# EasyEDA Pro project V3-POJ-STM32F103C8T6最小系统.epro

# Schematic Schematic1
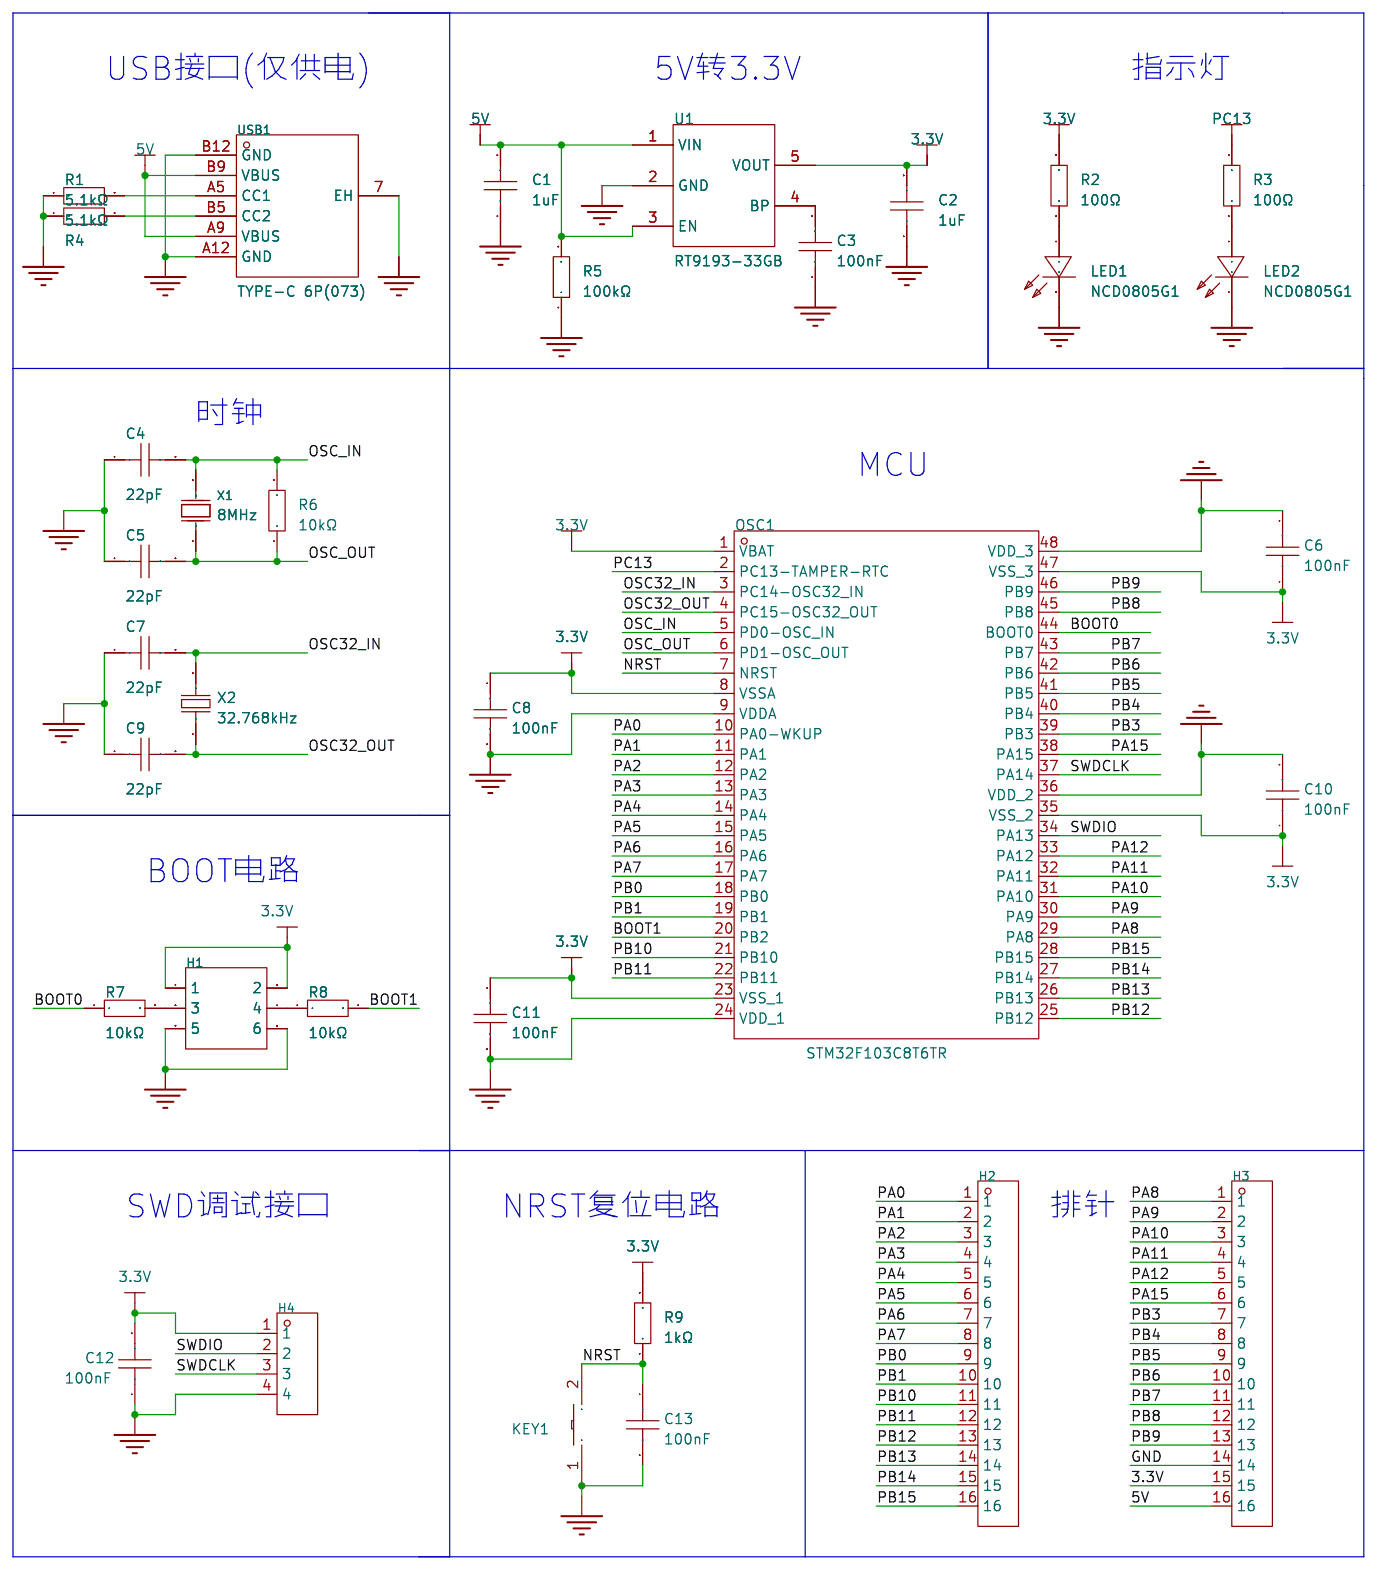
[diagram p0: schematic sheet]

## Parts
C1  1uF  [C0805]
C2  1uF  [C0805]
C3  100nF  [C0805]
C4  22pF  [C0805]
C5  22pF  [C0805]
C6  100nF  [C0805]
C7  22pF  [C0805]
C8  100nF  [C0805]
C9  22pF  [C0805]
C10  100nF  [C0805]
C11  100nF  [C0805]
C12  100nF  [C0805]
C13  100nF  [C0805]
H1  2.54-2*3P针  [HDR-TH_6P-P2.54-V-M-R2-C3-S2.54-1]
H2  X6511WV-16H-C30D60  [HDR-TH_16P-P2.54-V-M]
H3  X6511WV-16H-C30D60  [HDR-TH_16P-P2.54-V-M]
H4  PZ254R-11-04P  [HDR-TH_4P-P2.54-H-M-W10.4]
KEY1  TS-1101-C-W  [SW-SMD_L6.0-W3.3-LS8.0]
LED1  NCD0805G1  [LED0805-R-RD]
LED2  NCD0805G1  [LED0805-R-RD]
OSC1  STM32F103C8T6TR  [LQFP-48_L7.0-W7.0-P0.50-LS9.0-BL]
R1  5.1kΩ  [R0805]
R2  100Ω  [R0805]
R3  100Ω  [R0805]
R4  5.1kΩ  [R0805]
R5  100kΩ  [R0805]
R6  10kΩ  [R0805]
R7  10kΩ  [R0805]
R8  10kΩ  [R0805]
R9  1kΩ  [R0805]
U1  RT9193-33GB  [SOT-23-5_L3.0-W1.7-P0.95-LS2.8-BL]
USB1  TYPE-C 6P(073)  [TYPE-C-SMD_TYPE-C-6P]
X1  8MHz  [CRYSTAL-SMD_L5.0-W3.2]
X2  32.768kHz  [FC-135R_L3.2-W1.5]

## Library data of the parts
C1 C2 = 0805B105K500NT: 容值:1uF;精度:±10%;额定电压:50V;材质(温度系数):X7R;; LCSC Part Name: 1uF ±10% 50V; Supplier Part: C215803; Manufacturer: FH(风华); Supplier Footprint: 0805; JLCPCB Part Class: Extended Part; Datasheet: https://atta.szlcsc.com/upload/public/pdf/source/20180530/C215803_D57791C2287FC18831C4E0C7838E6BEC.pdf; Supplier: LCSC; Tolerance: ±10%; Voltage Rated: 50V; Temperature Coefficient: X7R
C3 C6 C8 C10-C13 = 0805B104K500NT: 容值:100nF;精度:±10%;额定电压:50V;材质(温度系数):X7R;; LCSC Part Name: 100nF ±10% 50V; Supplier Part: C38141; Manufacturer: FH(风华); Supplier Footprint: 0805; JLCPCB Part Class: Extended Part; Datasheet: https://atta.szlcsc.com/upload/public/pdf/source/20170923/C38141_1506149447419988747.pdf; Supplier: LCSC; Tolerance: ±10%; Voltage Rated: 50V; Temperature Coefficient: X7R
C4 C5 C7 C9 = 0805CG220J500NT: 容值:22pF;精度:±5%;额定电压:50V;材质(温度系数):C0G;; LCSC Part Name: 22pF ±5% 50V; Supplier Part: C24658; Manufacturer: FH(风华); Supplier Footprint: 0805; JLCPCB Part Class: Extended Part; Datasheet: https://atta.szlcsc.com/upload/public/pdf/source/20170923/C24658_1506149422956988697.pdf; Supplier: LCSC; Tolerance: ±5%; Voltage Rated: 50V; Temperature Coefficient: C0G
H1 = 2.54-2*3P针: 排数:双排;总PIN位数:6P;间距:2.54mm;插针结构:-;行距:-;安装类型:直插;圆针/方针:-;额定电流:-;额定电压:-;配合针长度:-;塑高:-;触头材质:-;触头镀层:-;颜色:黑色;; LCSC Part Name: 2.54mm 直插; Supplier Part: C65114; Manufacturer: BOOMELE(博穆精密); Supplier Footprint: 插件,P=2.54mm; JLCPCB Part Class: Extended Part; Supplier: LCSC; Number of Rows: 双排; Number of Pins: 6P; Pitch: 2.54mm; Mounting Type: 直插; Color: 黑色
H2 H3 = X6511WV-16H-C30D60: 排数:单排;总PIN位数:16;间距:2.54mm;插针结构:1x16P;行距:-;安装类型:直插;圆针/方针:方针;额定电流:3A;额定电压:250V;配合针长度:6mm;塑高:2.5mm;端接针长度:3mm;触头材质:黄铜;触头镀层:金;工作温度范围:-40℃~+105℃;焊接温度(最大值):260℃;颜色:黑色;; LCSC Part Name: 2.54mm 1x16P 直插 方针; Supplier Part: C725948; Manufacturer: XKB Connectivity(中国星坤); Supplier Footprint: 插件,P=2.54mm; JLCPCB Part Class: Extended Part; Supplier: LCSC; Number of Rows: 单排; Number of Pins: 16; Pitch: 2.54mm; Pin Structure: 1x16P; Mounting Type: 直插; Circluar Pins/Square Pins: 方针; Current Rating (Max): 3A; Voltage Rating (Max): 250V; Length of Mating Pin: 6mm; Insulation Height: 2.5mm; Length of End Connection Pin: 3mm; Contact Material: 黄铜; Contact Plating: 金; Operating Temperature Range: -40℃~+105℃; Welding Temperature (Max): 260℃; Color: 黑色
H4 = PZ254R-11-04P: 间距:2.54mm;总PIN位数:4;排数:1;插针结构:1x4P;行距:-;安装类型:弯插;圆针/方针:方针;额定电流:-;额定电压:-;配合针长度:6mm;塑高:2.5mm;触头材质:黄铜;触头镀层:-;工作温度范围:-40℃~+105℃;颜色:黑色;; LCSC Part Name: 2.54mm 1x4P 弯插 方针; Supplier Part: C492412; Manufacturer: XFCN(兴飞); Supplier Footprint: 插件,P=2.54mm; JLCPCB Part Class: Extended Part; Datasheet: https://atta.szlcsc.com/upload/public/pdf/source/20200309/C492403_F9F19131791D08044AD4F84F8E751A34.pdf; Supplier: LCSC; Pitch: 2.54mm; Number of Pins: 4; Number of Rows: 1; Pin Structure: 1x4P; Mounting Type: 弯插; Circluar Pins/Square Pins: 方针; Length of Mating Pin: 6mm; Insulation Height: 2.5mm; Contact Material: 黄铜; Operating Temperature Range: -40℃~+105℃; Color: 黑色; Length of End Connection Pin: 3mm
KEY1 = TS-1101-C-W: 触点电流:50mA;额定电压(AC):-;额定电压(DC):12V;额定功率:-;绝缘电阻:-;电路结构:单刀单掷;安装方式:立贴;带灯:无;作用力:260gf;机械寿命:5万次;带支架:否;; LCSC Part Name: 立贴 6*3.6*2.5mm 轻触开关 一型3*6*2.5有白ZD b拉伸白色带淡绿按键 卷装; Supplier Part: C318938; Manufacturer: XKB Connectivity(中国星坤); Supplier Footprint: SMD; JLCPCB Part Class: Extended Part; Datasheet: https://atta.szlcsc.com/upload/public/pdf/source/20200227/C318938_C2E53B1EEDE37D980A33616AC086DE53.pdf; Supplier: LCSC; Contact Current: 50mA; Voltage Rating (DC): 12V; Circuit: 单刀单掷; Mounting Style: 立贴; Actuator Style: 矩形按钮; Actuator/Cap Color: 白色带淡绿; With Lamp: 无; Operating Force: 260gf; Mechanical Life: 5万次; Operating Temperature: -30℃~+85℃; Switch Length: 6mm; Switch Width: 3.6mm; Switch Height: 2.5mm; Strike Gundam: 否
LED1 LED2 = NCD0805G1: 发光颜色:翠绿;; LCSC Part Name: 翠绿 0805翠绿  正贴; Supplier Part: C84260; Manufacturer: 国星光电; Supplier Footprint: 0805; JLCPCB Part Class: Extended Part; Datasheet: https://atta.szlcsc.com/upload/public/pdf/source/20200820/C84260_AFC7BF57C6FBA034D182BB8D10A67EFE.pdf; Supplier: LCSC; Emitted Color: 翠绿
OSC1 = STM32F103C8T6TR: Supplier Part: C2969777; Manufacturer: ST(意法半导体); Supplier Footprint: LQFP-48; JLCPCB Part Class: Extended Part; Datasheet: https://atta.szlcsc.com/upload/public/pdf/source/20220628/95EE8CB51361BFD20205E6D0986143A8.pdf; Supplier: LCSC
R1 R4 = 0805W8F5101T5E: 电阻类型:厚膜电阻;阻值:5.1kΩ;精度:±1%;功率:125mW;; LCSC Part Name: 5.1kΩ ±1% 125mW; Supplier Part: C27834; Manufacturer: UNI-ROYAL(厚声); Supplier Footprint: 0805; JLCPCB Part Class: Basic Part; Datasheet: https://atta.szlcsc.com/upload/public/pdf/source/20200306/C422600_1E6D84923E4A46A82E41ADD87F860B5C.pdf; Supplier: LCSC; Type: 厚膜电阻; Tolerance: ±1%; Power(Watts): 125mW; Temperature Coefficient: ±100ppm/℃; Overload Voltage (Max): 150V; Operating Temperature Range: -55℃~+155℃
R2 R3 = 0805W8F1000T5E: 电阻类型:厚膜电阻;阻值:100Ω;精度:±1%;功率:125mW;; LCSC Part Name: 100Ω ±1% 125mW; Supplier Part: C17408; Manufacturer: UNI-ROYAL(厚声); Supplier Footprint: 0805; JLCPCB Part Class: Basic Part; Datasheet: https://atta.szlcsc.com/upload/public/pdf/source/20200306/C422600_1E6D84923E4A46A82E41ADD87F860B5C.pdf; Supplier: LCSC; Type: 厚膜电阻; Tolerance: ±1%; Power(Watts): 125mW; Temperature Coefficient: ±100ppm/℃; Overload Voltage (Max): 150V; Operating Temperature Range: -55℃~+155℃
R5 = 0805W8F1003T5E: 电阻类型:厚膜电阻;阻值:100kΩ;精度:±1%;功率:125mW;; LCSC Part Name: 100kΩ ±1% 125mW; Supplier Part: C149504; Manufacturer: UNI-ROYAL(厚声); Supplier Footprint: 0805; JLCPCB Part Class: Basic Part; Datasheet: https://atta.szlcsc.com/upload/public/pdf/source/20200306/C422600_1E6D84923E4A46A82E41ADD87F860B5C.pdf; Supplier: LCSC; Type: 厚膜电阻; Tolerance: ±1%; Power(Watts): 125mW; Temperature Coefficient: ±100ppm/℃; Overload Voltage (Max): 150V; Operating Temperature Range: -55℃~+155℃
R6-R8 = 0805W8F1002T5E_C17414: 电阻类型:厚膜电阻;阻值:10kΩ;精度:±1%;功率:125mW;; LCSC Part Name: 10kΩ ±1% 125mW; Supplier Part: C17414; Manufacturer: UNI-ROYAL(厚声); Manufacturer Part: 0805W8F1002T5E; Supplier Footprint: 0805; JLCPCB Part Class: Basic Part; Datasheet: https://atta.szlcsc.com/upload/public/pdf/source/20200306/C422600_1E6D84923E4A46A82E41ADD87F860B5C.pdf; Supplier: LCSC; Type: 厚膜电阻; Tolerance: ±1%; Power(Watts): 125mW; Temperature Coefficient: ±100ppm/℃; Overload Voltage (Max): 150V; Operating Temperature Range: -55℃~+155℃
R9 = 0805W8F1001T5E: 电阻类型:厚膜电阻;阻值:1kΩ;精度:±1%;功率:125mW;; LCSC Part Name: 1kΩ ±1% 125mW; Supplier Part: C17513; Manufacturer: UNI-ROYAL(厚声); Supplier Footprint: 0805; JLCPCB Part Class: Basic Part; Datasheet: https://atta.szlcsc.com/upload/public/pdf/source/20200306/C422600_1E6D84923E4A46A82E41ADD87F860B5C.pdf; Supplier: LCSC; Type: 厚膜电阻; Tolerance: ±1%; Power(Watts): 125mW; Temperature Coefficient: ±100ppm/℃; Overload Voltage (Max): 150V; Operating Temperature Range: -55℃~+155℃
U1 = RT9193-33GB: 输出类型:固定;输出极性:正;输出通道数:1;最大输入电压:5.5V;输出电压:3.3V;压差:300mV@(300mA);输出电流:300mA;电源纹波抑制比(PSRR):70dB;; LCSC Part Name: 正 Vin=5.5V Vout=3.3V 300mA 70dB; Supplier Part: C15651; Manufacturer: RICHTEK(立锜); Supplier Footprint: SOT-23-5; JLCPCB Part Class: Extended Part; Datasheet: https://atta.szlcsc.com/upload/public/pdf/source/20130730/1457706628575.pdf; Supplier: LCSC; Output Type: 固定; Output Polarity: 正; Number of Outputs: 1; Maximum Input Voltage: 5.5V; Output Voltage: 3.3V; Dropout Voltage: 300mV@(300mA); Output Current: 300mA; Power Supply Rejection Ratio (PSRR): 70dB
USB1 = TYPE-C 6P(073): 连接器类型:Type-C;标准:-;公母:母座;触点数量:6P;端口数量:1;安装方式:卧贴;额定电流 - 电源:5A;工作温度范围:-25℃~+85℃;; LCSC Part Name: Type-C 母座 卧贴; Supplier Part: C668623; Manufacturer: SHOU HAN(首韩); Supplier Footprint: SMD; JLCPCB Part Class: Extended Part; Datasheet: https://atta.szlcsc.com/upload/public/pdf/source/20200618/C668623_A4B260DED7AC1949BAC6AE39E9F4CD80.pdf; Supplier: LCSC; Connector Type: Type-C; Gender: 母座; Number of Contacts: 6P; Number of Ports: 1; Mounting Style: 卧贴; Current Rating - Power (Max): 5A; Operating Temperature Range: -25℃~+85℃
X1 = X50328MSB2GI: 频率:8MHz;频率公差:±10ppm;负载电容:20pF;; LCSC Part Name: 8MHz ±10ppm 20pF YSX530GA YSX530GA; Supplier Part: C115962; Manufacturer: YXC(扬兴晶振); Supplier Footprint: SMD5032-2P; JLCPCB Part Class: Basic Part; Datasheet: https://atta.szlcsc.com/upload/public/pdf/source/20230220/0EBFFB9D6D8CE6A211407822BBB6C516.pdf; Supplier: LCSC; Crystal Type: 贴片无源晶振; Frequency Tolerance: ±10ppm; Frequency Stability: ±50ppm; Load Capacitance: 20pF; Operating Temperature: -40℃~+85℃
X2 = Q13FC1350000400: 频率:32.768kHz;频率公差:±20ppm;负载电容:12.5pF;; LCSC Part Name: 32.768kHz ±20ppm 12.5pF; Supplier Part: C32346; Manufacturer: EPSON(爱普生); Supplier Footprint: SMD3215-2P; JLCPCB Part Class: Basic Part; Datasheet: https://atta.szlcsc.com/upload/public/pdf/source/20190108/C32346_746D6B07EAF90824457A96480007685F.pdf; Supplier: LCSC; Crystal Type: 贴片无源晶振; Frequency Tolerance: ±20ppm; Load Capacitance: 12.5pF; Equivalent Series Resistance (ESR): 70kΩ; Operating Temperature: -40℃~+85℃

## Nets
3.3V: C2.2 C6.1 C8.1 C10.1 C11.1 C12.2 H1.1 H1.2 H3.15 H4.1 OSC1.1(VBAT) OSC1.8(VSSA) OSC1.23(VSS_1) OSC1.35(VSS_2) OSC1.47(VSS_3) R2.2 R9.2 U1.5(VOUT)
5V: C1.2 H3.16 R5.2 U1.1(VIN) U1.3(EN) USB1.A9(VBUS) USB1.B9(VBUS)
GND: C1.1 C2.1 C3.1 C4.1 C5.1 C6.2 C7.1 C8.2 C9.1 C10.2 C11.2 C12.1 C13.2 H1.5 H1.6 H3.14 H4.4 KEY1.1 LED1.2(K) LED2.2(K) OSC1.9(VDDA) OSC1.24(VDD_1) OSC1.36(VDD_2) OSC1.48(VDD_3) R1.1 R4.1 R5.1 U1.2(GND) USB1.7(EH) USB1.A12(GND) USB1.B12(GND)
BOOT0: OSC1.44(BOOT0) R7.1
BOOT1: OSC1.20(PB2) R8.2
NRST: C13.1 KEY1.2 OSC1.7(NRST) R9.1
OSC32_IN: C7.2 OSC1.3(PC14-OSC32_IN) X2.2
OSC32_OUT: C9.2 OSC1.4(PC15-OSC32_OUT) X2.1
OSC_IN: C4.2 OSC1.5(PD0-OSC_IN) R6.2 X1.2(OSC2)
OSC_OUT: C5.2 OSC1.6(PD1-OSC_OUT) R6.1 X1.1(OSC1)
PA0: H2.1 OSC1.10(PA0-WKUP)
PA1: H2.2 OSC1.11(PA1)
PA2: H2.3 OSC1.12(PA2)
PA3: H2.4 OSC1.13(PA3)
PA4: H2.5 OSC1.14(PA4)
PA5: H2.6 OSC1.15(PA5)
PA6: H2.7 OSC1.16(PA6)
PA7: H2.8 OSC1.17(PA7)
PA8: H3.1 OSC1.29(PA8)
PA9: H3.2 OSC1.30(PA9)
PA10: H3.3 OSC1.31(PA10)
PA11: H3.4 OSC1.32(PA11)
PA12: H3.5 OSC1.33(PA12)
PA15: H3.6 OSC1.38(PA15)
PB0: H2.9 OSC1.18(PB0)
PB1: H2.10 OSC1.19(PB1)
PB3: H3.7 OSC1.39(PB3)
PB4: H3.8 OSC1.40(PB4)
PB5: H3.9 OSC1.41(PB5)
PB6: H3.10 OSC1.42(PB6)
PB7: H3.11 OSC1.43(PB7)
PB8: H3.12 OSC1.45(PB8)
PB9: H3.13 OSC1.46(PB9)
PB10: H2.11 OSC1.21(PB10)
PB11: H2.12 OSC1.22(PB11)
PB12: H2.13 OSC1.25(PB12)
PB13: H2.14 OSC1.26(PB13)
PB14: H2.15 OSC1.27(PB14)
PB15: H2.16 OSC1.28(PB15)
PC13: OSC1.2(PC13-TAMPER-RTC) R3.2
SWDCLK: H4.3 OSC1.37(PA14)
SWDIO: H4.2 OSC1.34(PA13)
$1N6381: H1.3 R7.2
$1N6407: H1.4 R8.1
$1N9013: C3.2 U1.4(BP)
$1N15535: R4.2 USB1.B5(CC2)
$1N15536: R1.2 USB1.A5(CC1)
Net-(LED1-1): LED1.1(A) R2.1
Net-(LED2-1): LED2.1(A) R3.1

## Notes on the sheet
- USB接口(仅供电)
- 5V转3.3V
- 指示灯
- 时钟
- MCU
- BOOT电路
- SWD调试接口
- NRST复位电路
- 排针

# Board PCB1
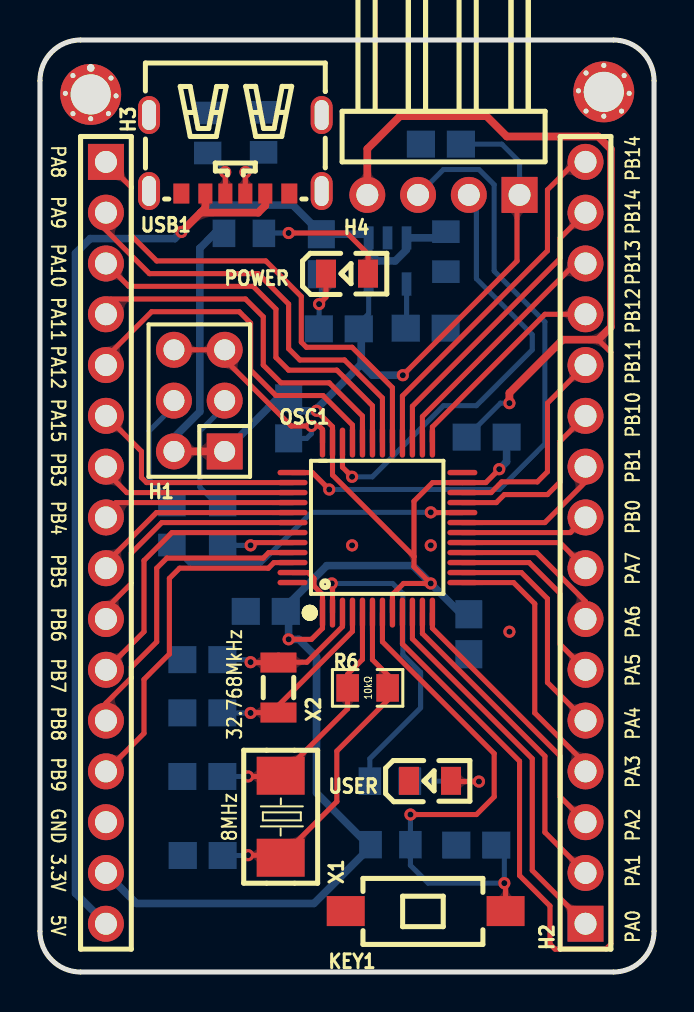
[diagram p1: board, top side]
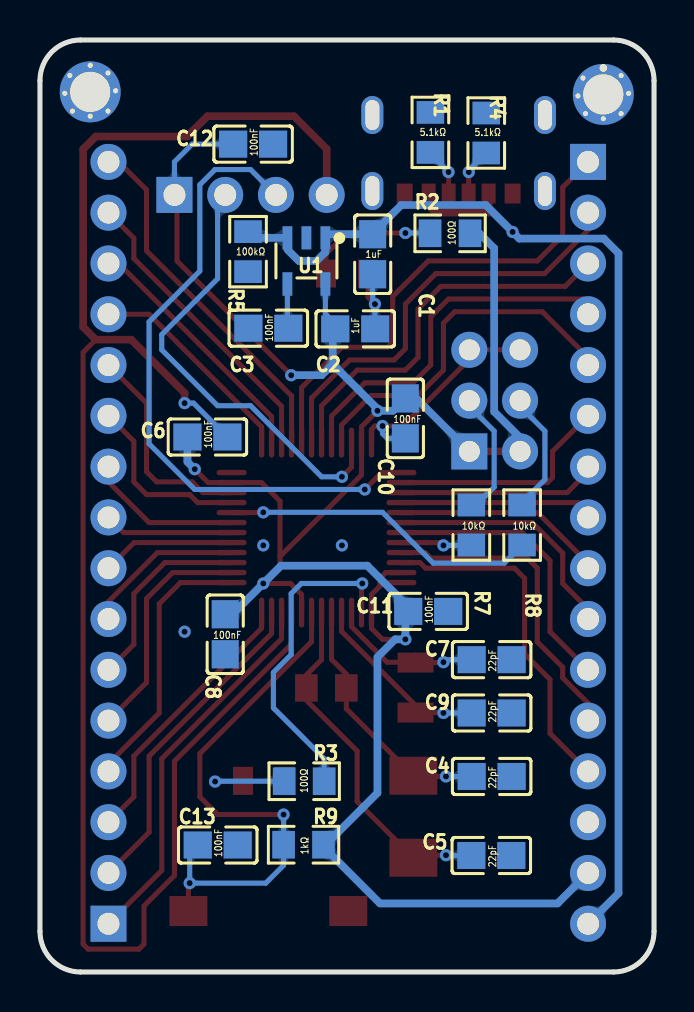
[diagram p2: board, bottom side, seen from below]

Outline 30.73 x 46.61 mm; copper layers: Top Layer, Bottom Layer. Coordinates in mm from the lower left corner of the outline.
Outline path: 0,44.58 0,2.03 arc(0.6,0.6) 2.03,0 28.7,0 arc(30.14,0.6) 30.73,2.03 30.73,44.58 arc(30.14,46.01) 28.7,46.61 2.03,46.61 arc(0.6,46.01) 0,44.58
Stack: Top Layer 0.035mm / Dielectric1 1.51mm FR4 er 4.5 / Bottom Layer 0.035mm

## Design rules (mm)
template: JLCPCB Capability(Two Layers Board)
spacing copperThickness1oz (default): track to track 0.102, other pairs 0.152 to 0.3
spacing copperThickness2oz: track to track 0.203, other pairs 0.152 to 0.3
track width copperThickness1oz (default): min 0.127, default 0.254, max 2.54
track width copperThickness2oz: min 0.203, default 0.254, max 2.54
differential pair differentialPair (default): width min 0.127, default 0.254, max 2.54; gap min 0.152, default 0.152
via viaSize (default): diameter min 0.5, default 0.61, max 10; hole min 0.3, default 0.305, max 6.3

## Placement (name value [footprint] x y rotation side)
C1  1uF  [C0805]  14.08 35.89 90 bottom
C2  1uF  [C0805]  14.95 32.16 0 bottom
C3  100nF  [C0805]  19.3 32.2 180 bottom
C4  22pF  [C0805]  8.13 9.78 0 bottom
C5  22pF  [C0805]  8.14 5.83 0 bottom
C6  100nF  [C0805]  22.35 26.75 180 bottom
C7  22pF  [C0805]  8.13 15.62 0 bottom
C8  100nF  [C0805]  21.46 16.89 270 bottom
C9  22pF  [C0805]  8.13 12.95 0 bottom
C10  100nF  [C0805]  12.45 27.69 270 bottom
C11  100nF  [C0805]  11.3 18.03 180 bottom
C12  100nF  [C0805]  20.07 41.4 0 bottom
C13  100nF  [C0805]  21.84 6.35 180 bottom
H1  2.54-2*3P针  [HDR-TH_6P-P2.54-V-M-R2-C3-S2.54-1]  7.98 28.57 90 top
H2  X6511WV-16H-C30D60  [HDR-TH_16P-P2.54-V-M]  27.31 21.46 90 top
H3  X6511WV-16H-C30D60  [HDR-TH_16P-P2.54-V-M]  3.3 21.46 270 top
H4  PZ254R-11-04P  [HDR-TH_4P-P2.54-H-M-W10.4]  20.19 38.86 180 top
KEY1  TS-1101-C-W  [SW-SMD_L6.0-W3.3-LS8.0]  19.3 3.05 0 top
NOREF  -  [Pad_e17326]  3.81 43.81 0 top
NOREF#2  -  [Pad_e17608]  27.33 44.96 0 top
NOREF#3  -  [Pad_e17323]  2.54 45.21 0 top
NOREF#4  -  [Pad_e17614]  29.24 44.83 0 top
NOREF#5  -  [Pad_e17330]  1.65 42.93 0 top
NOREF#6  -  [Pad_e17325]  2.54 42.67 0 top
NOREF#7  -  [Pad_e17613]  29.49 43.94 0 top
NOREF#8  -  [Pad_e17329]  3.56 44.7 0 top
NOREF#9  -  [Pad_e17328]  3.43 42.93 0 top
NOREF#10  -  [Pad_e17037]  2.54 43.89 0 top
NOREF#11  -  [Pad_e17327]  1.27 43.94 0 top
NOREF#12  -  [Pad_e17609]  28.22 44.01 0 top
NOREF#13  -  [Pad_e17607]  26.95 44.07 0 top
NOREF#14  -  [Pad_e17610]  27.33 43.05 0 top
NOREF#15  -  [Pad_e17612]  28.22 42.8 0 top
NOREF#16  -  [Pad_e17615]  29.11 43.05 0 top
NOREF#17  -  [Pad_e17331]  1.65 44.83 0 top
NOREF#18  -  [Pad_e17611]  28.22 45.34 0 top
OSC1  STM32F103C8T6TR  [LQFP-48_L7.0-W7.0-P0.50-LS9.0-BL]  16.89 22.22 0 top
POWER  NCD0805G1  [LED0805-R-RD]  15.37 34.92 0 top
R1  5.1kΩ  [R0805]  11.19 41.99 270 bottom
R2  100Ω  [R0805]  10.21 36.94 180 bottom
R3  100Ω  [R0805]  17.51 9.54 180 bottom
R4  5.1kΩ  [R0805]  8.4 41.96 270 bottom
R5  100kΩ  [R0805]  20.32 36.02 90 bottom
R6  10kΩ  [R0805]  16.4 14.21 180 top
R7  10kΩ  [R0805]  9.14 22.35 90 bottom
R8  10kΩ  [R0805]  6.6 22.35 270 bottom
R9  1kΩ  [R0805]  17.54 6.37 180 bottom
U1  RT9193-33GB  [SOT-23-5_L3.0-W1.7-P0.95-LS2.8-BL]  17.4 35.56 0 bottom
USB1  TYPE-C 6P(073)  [TYPE-C-SMD_TYPE-C-6P]  9.78 40.89 180 top
USER  NCD0805G1  [LED0805-R-RD]  19.52 9.56 0 top
X1  8MHz  [CRYSTAL-SMD_L5.0-W3.2]  12.05 7.76 90 top
X2  32.768kHz  [FC-135R_L3.2-W1.5]  11.94 14.22 90 top

## Footprints (pads in the part's own frame, mm; a bottom-side part is the same pattern mirrored in y, then rotated)
C0805
  rect 1.41x1.35 smd: 1(-1,0) 2(1,0)
CRYSTAL-SMD_L5.0-W3.2
  rect 1.9x2.4 smd: 1(-2.05,0) 2(2.05,0)
FC-135R_L3.2-W1.5
  rect 1x1.8 smd: 1(-1.25,0) 2(1.25,0)
HDR-TH_4P-P2.54-H-M-W10.4
  rect 1.8x1.8 hole 1.1: 1(-3.81,0)
  round 1.8 hole 1.1: 2(-1.27,0) 3(1.27,0) 4(3.81,0)
HDR-TH_6P-P2.54-V-M-R2-C3-S2.54-1
  rect 1.8x1.8 hole 1.05: 1(-2.54,-1.27)
  round 1.8 hole 1.05: 2(-2.54,1.27) 3(0,-1.27) 4(0,1.27) 5(2.54,-1.27) 6(2.54,1.27)
HDR-TH_16P-P2.54-V-M
  rect 1.8x1.8 hole 1.1: 1(-19.05,0)
  round 1.8 hole 1.1: 2(-16.51,0) 3(-13.97,0) 4(-11.43,0) 5(-8.89,0) 6(-6.35,0) 7(-3.81,0) 8(-1.27,0) 9(1.27,0) 10(3.81,0) 11(6.35,0) 12(8.89,0) 13(11.43,0) 14(13.97,0) 15(16.51,0) 16(19.05,0)
LED0805-R-RD
  rect 1x1.399 smd: 1(1.05,0) 2(-1.05,0)
LQFP-48_L7.0-W7.0-P0.50-LS9.0-BL
  oval 0.27x1.5 smd: 1(-2.75,-4.25) 2(-2.25,-4.25) 3(-1.75,-4.25) 4(-1.25,-4.25) 5(-0.75,-4.25) 6(-0.25,-4.25) 7(0.25,-4.25) 8(0.75,-4.25) 9(1.25,-4.25) 10(1.75,-4.25) 11(2.25,-4.25) 12(2.75,-4.25) 25(2.75,4.25) 26(2.25,4.25) 27(1.75,4.25) 28(1.25,4.25) 29(0.75,4.25) 30(0.25,4.25) 31(-0.25,4.25) 32(-0.75,4.25) 33(-1.25,4.25) 34(-1.75,4.25) 35(-2.25,4.25) 36(-2.75,4.25)
  oval 1.5x0.27 smd: 13(4.25,-2.75) 14(4.25,-2.25) 15(4.25,-1.75) 16(4.25,-1.25) 17(4.25,-0.75) 18(4.25,-0.25) 19(4.25,0.25) 20(4.25,0.75) 21(4.25,1.25) 22(4.25,1.75) 23(4.25,2.25) 24(4.25,2.75) 37(-4.25,2.75) 38(-4.25,2.25) 39(-4.25,1.75) 40(-4.25,1.25) 41(-4.25,0.75) 42(-4.25,0.25) 43(-4.25,-0.25) 44(-4.25,-0.75) 45(-4.25,-1.25) 46(-4.25,-1.75) 47(-4.25,-2.25) 48(-4.25,-2.75)
Pad_e17037
  round 3.048 hole 2.006: 5(0,0)
Pad_e17323
  round 0.381 hole 2.006x0.254: 6(0,0)
Pad_e17325
  round 0.381 hole 0.254: 6(0,0)
Pad_e17326
  round 0.381 hole 0.254: 6(0,0)
Pad_e17327
  round 0.381 hole 0.254: 6(0,0)
Pad_e17328
  round 0.381 hole 0.254: 6(0,0)
Pad_e17329
  round 0.381 hole 0.254: 6(0,0)
Pad_e17330
  round 0.381 hole 0.254: 6(0,0)
Pad_e17331
  round 0.381 hole 0.254: 6(0,0)
Pad_e17607
  round 0.381 hole 0.254: 6(0,0)
Pad_e17608
  round 0.381 hole 0.254: 6(0,0)
Pad_e17609
  round 3.048 hole 2.006: 5(0,0)
Pad_e17610
  round 0.381 hole 0.254: 6(0,0)
Pad_e17611
  round 0.381 hole 0.254: 6(0,0)
Pad_e17612
  round 0.381 hole 0.254: 6(0,0)
Pad_e17613
  round 0.381 hole 0.254: 6(0,0)
Pad_e17614
  round 0.381 hole 0.254: 6(0,0)
Pad_e17615
  round 0.381 hole 0.254: 6(0,0)
R0805
  rect 1.133x1.377 smd: 1(-1,0) 2(1,0)
SOT-23-5_L3.0-W1.7-P0.95-LS2.8-BL
  rect 0.49x1.157 smd: 1(-0.95,-1.153) 2(0,-1.153) 3(0.95,-1.153)
  rect 0.49x1.175 smd: 4(0.95,1.153) 5(-0.95,1.153)
SW-SMD_L6.0-W3.3-LS8.0
  rect 1.9x1.5 smd: 1(-4,0) 2(4,0)
TYPE-C-SMD_TYPE-C-6P
  oval 1.1x1.9 hole 0.7x1.5: 7(-4.32,1.837) 7(-4.32,-1.962) 7(4.32,1.837) 7(4.32,-1.962)
  rect 0.7x1 smd: A5(-0.5,1.962) A9(1.5,1.962) B5(0.5,1.962) B9(-1.5,1.962)
  rect 0.8x1 smd: A12(2.7,1.962) B12(-2.7,1.962)

## Nets
As in the schematic, except:
GND: C1.1 C2.1 C3.1 C4.1 C5.1 C6.2 C7.1 C8.2 C9.1 C10.2 C11.2 C12.1 C13.2 H1.5 H1.6 H3.14 H4.4 KEY1.1 NOREF#2.6 NOREF#4.6 NOREF#7.6 NOREF#12.5 NOREF#13.6 NOREF#14.6 NOREF#15.6 NOREF#16.6 NOREF#18.6 OSC1.9 OSC1.24 OSC1.36 OSC1.48 POWER.2 R1.1 R4.1 R5.1 U1.2 USB1.7 USB1.A12 USB1.B12 USER.2
$1N5715: POWER.1 R2.1
$1N15357: R3.1 USER.1

Pads without a net: NOREF 6; NOREF#3 6; NOREF#5 6; NOREF#6 6; NOREF#8 6; NOREF#9 6; NOREF#10 5; NOREF#11 6; NOREF#17 6

## Via types
v1: diameter 0.61, hole 0.305, Top Layer to Bottom Layer, 27 vias

## Routing (per net, layer and track width the routed paths; a pad name or vN(x,y) marks a point on that pad's centre or on a via; arc(x,y) is an arc through that point)
3.3V: length 116.4
  Top Layer w0.254: v1(12.45,16.64) 13.59,16.64 14.14,17.19 OSC1.1 14.14,18.88 13.72,19.3 13.72,19.68 13.43,19.97 OSC1.47 ; 18.72,20.78 18.72,23.55 19.65,24.47 OSC1.23 22.32,24.47 v1(22.99,25.15) ; 18.72,20.78 14.64,24.86 OSC1.35 14.64,27.27 v1(13.84,28.07) ; 18.72,20.78 18.72,20.27 v1(19.56,19.43) 18.19,19.43 17.64,18.88 OSC1.8 ; H4.1 23.88,38.73 23.88,35.56 v1(18.16,29.84)
  Top Layer w0.381: H1.1 H1.2
  Bottom Layer w0.254: H4.1 24,40.51 23.11,41.4 C12.2 ; 16.08,32.22 16.08,32.54 16.45,32.91 U1.5
  Bottom Layer w0.381: 16.08,30.4 16.64,29.84 v1(18.16,29.84) ; 16.08,30.4 16.08,32.22 ; 16.08,30.4 13.84,28.16 v1(13.84,28.07) 13.06,28.07 C10.1 11.9,28.69 H1.1 ; C6.1 23.35,25.51 v1(22.99,25.15) ; 16.54,6.25 13.72,3.43 4.83,3.43 H3.15 ; 16.54,6.25 13.84,8.95 13.84,15.75 12.95,16.64 v1(12.45,16.64) 12.45,17.89 C11.1 12.3,18.27 14.35,20.32 18.67,20.32 v1(19.56,19.43) 21.1,17.89 C8.1 ; 16.54,6.25 R9.2 ; H1.2 6.71,26.73 8,28.02 8,36.19 8.75,36.94 R2.2
5V: length 62.6
  Top Layer w0.381: 8.04,37.97 8.28,38.21 USB1.A9 ; 8.04,37.97 v1(7.08,37.01) ; 8.04,37.97 10.92,37.97 11.28,38.33 USB1.B9
  Bottom Layer w0.254: 18.35,36.13 U1.3
  Bottom Layer w0.381: 18.35,36.13 17.78,35.56 16.89,35.56 16.45,36 U1.1 16.27,36.89 C1.2 14.08,36.92 12.65,38.35 8.42,38.35 v1(7.08,37.01) 6.75,36.68 2.51,36.68 1.78,35.94 1.78,3.94 H3.16 ; U1.3 20.01,36.71 R5.2
GND: length 104
  Top Layer w0.254: 27.94,31.62 28.57,30.99 28.57,1.4 28.32,1.14 25.78,1.14 25.53,1.4 25.53,3.3 24,4.83 24,10.54 18.14,16.4 OSC1.9 ; H1.6 H1.5 9.25,30.63 12.57,27.3 v1(13.59,27.3) 13.97,27.3 14.14,27.13 OSC1.36 ; POWER.2 14.32,33.75 v1(13.97,33.4)
  Top Layer w0.381: v1(23.5,28.45) 23.5,28.96 26.16,31.62 27.94,31.62 28.57,32.26 28.57,41.15 27.94,41.78 23.37,41.78 22.35,42.8 18.02,42.8 16.38,41.16 H4.4
  Bottom Layer w0.254: v1(13.59,27.3) 13.59,26.92 13.35,26.69 C10.2 ; C2.1 13.97,32.18 v1(13.97,33.4) 14.08,33.51 C1.1 ; C6.2 23.05,28.45 v1(23.5,28.45)
  vias: v1(15.62,21.34) v1(19.56,21.34) v1(23.5,17.02)
BOOT0: length 3.7
  Top Layer w0.254: OSC1.44 10.68,21.47 v1(10.54,21.34)
  Bottom Layer w0.254: v1(10.54,21.34) 9.41,21.34 9.14,21.6
BOOT1: length 15.8
  Top Layer w0.254: v1(19.56,22.99) 19.57,22.97 OSC1.20
  Bottom Layer w0.254: 6.99,21.35 6.99,20.95 7.49,20.45 11.05,20.45 13.59,22.99 v1(19.56,22.99)
NRST: length 27.2
  Top Layer w0.254: OSC1.7 17.14,16.51 22.73,10.92 22.73,8.76 21.84,7.87 v1(18.54,7.87) ; KEY1.2 23.3,4.38 v1(23.24,4.44)
  Bottom Layer w0.254: v1(18.54,7.87) R9.1 18.54,5.33 19.43,4.44 v1(23.24,4.44) 23.24,5.94 C13.1
OSC32_IN: length 7.9
  Top Layer w0.254: OSC1.3 15.14,17.27 13.36,15.49 11.96,15.49 X2.2 10.56,15.47 v1(10.54,15.49) ; 11.94,15.85 12.17,15.62
  Bottom Layer w0.254: C7.2 10.41,15.62 v1(10.54,15.49)
OSC32_OUT: length 9.4
  Top Layer w0.254: v1(10.54,12.95) 10.56,12.97 X2.1 11.94,13.33 15.64,17.04 OSC1.4
  Bottom Layer w0.254: C9.2 10.54,12.95
OSC_IN: length 12.8
  Top Layer w0.254: OSC1.5 16.14,15.63 15.4,14.89 R6.2 15.4,13.17 X1.2 12.01,9.78 v1(10.41,9.78)
  Bottom Layer w0.254: C4.2 v1(10.41,9.78)
OSC_OUT: length 17.9
  Top Layer w0.254: OSC1.6 16.64,15.62 17.53,14.73 17.53,13.72 14.86,11.05 14.86,8.53 X1.1 11.92,5.84 v1(10.41,5.84)
  Bottom Layer w0.254: C5.2 10.4,5.83 v1(10.41,5.84)
PA0: length 19.2
  Top Layer w0.254: OSC1.10 18.64,16.66 24.64,10.67 24.64,5.08 H2.1
PA1: length 16.4
  Top Layer w0.254: H2.2 25.27,6.98 25.27,10.79 19.14,16.93 OSC1.11
PA2: length 13.7
  Top Layer w0.254: OSC1.12 19.64,17.19 26.03,10.8 26.03,8.76 H2.3
PA3: length 13.5
  Top Layer w0.254: OSC1.13 23.71,19.47 24.76,18.41 24.76,12.95 27.31,10.41 H2.4
PA4: length 11.7
  Top Layer w0.254: H2.5 25.4,14.48 25.4,18.67 24.09,19.97 OSC1.14
PA5: length 9.9
  Top Layer w0.254: OSC1.15 24.48,20.47 26.03,18.92 26.03,16.38 H2.6
PA6: length 8.1
  Top Layer w0.254: H2.7 27.31,18.52 24.85,20.97 OSC1.16
PA7: length 6.7
  Top Layer w0.254: H2.8 26.02,21.47 OSC1.17
PA8: length 24.5
  Top Layer w0.254: H3.1 4.57,39.24 4.57,36.83 5.84,35.56 11.3,35.56 13.08,33.78 13.08,31.5 13.34,31.24 15.62,31.24 17.64,29.22 OSC1.29
PA9: length 21.8
  Top Layer w0.254: OSC1.30 17.14,28.71 15.24,30.61 13.01,30.61 12.45,31.17 12.45,33.4 10.92,34.92 5.48,34.92 3.05,37.35 3.05,37.97
PA10: length 19.8
  Top Layer w0.254: OSC1.31 16.64,28.32 14.86,30.1 12.45,30.1 11.81,30.73 11.81,33.15 10.67,34.29 4.44,34.29 H3.3 3.05,35.43
PA11: length 18.9
  Top Layer w0.254: 3.05,32.89 H3.4 3.3,33.4 3.56,33.65 10.29,33.65 11.18,32.77 11.18,30.35 12.06,29.46 14.48,29.46 16.14,27.8 OSC1.32
PA12: length 18.5
  Top Layer w0.254: OSC1.33 15.64,27.35 14.16,28.83 11.81,28.83 10.54,30.1 10.54,32.45 9.97,33.02 5.59,33.02 3.3,30.73 H3.5 3.05,30.35
PA15: length 11.8
  Top Layer w0.254: 3.05,28.07 5.08,26.03 5.08,24.73 5.33,24.47 OSC1.38
PB0: length 6.5
  Top Layer w0.254: H2.9 26.55,21.97 OSC1.18
PB1: length 7.8
  Top Layer w0.254: H2.10 27.31,24.51 25.27,22.47 OSC1.19
PB3: length 10.1
  Top Layer w0.254: 3.05,25.27 4.35,23.97 OSC1.39
PB4: length 8.9
  Top Layer w0.254: 3.79,23.47 OSC1.40
PB5: length 10.7
  Top Layer w0.254: 3.05,20.19 5.83,22.97 OSC1.41
PB6: length 12.8
  Top Layer w0.254: 3.05,17.65 H3.10 3.3,18.16 4.57,19.43 4.57,20.95 6.1,22.47 OSC1.42
PB7: length 14.3
  Top Layer w0.254: H3.11 5.21,17.02 5.21,20.58 6.6,21.97 OSC1.43
PB8: length 15.8
  Top Layer w0.254: OSC1.45 11.45,20.97 11.18,20.7 6.35,20.7 5.84,20.19 5.84,16.51 4.57,15.24 4.57,14.71 3.3,13.44 H3.12
PB9: length 17.5
  Top Layer w0.254: H3.13 5.21,11.94 5.21,14.63 6.48,15.9 6.48,19.68 6.99,20.19 11.43,20.19 11.71,20.47 OSC1.46
PB10: length 9.2
  Top Layer w0.254: OSC1.21 22.84,23.47 23.24,23.88 25.4,23.88 26.03,24.51 26.03,26.54 H2.11
PB11: length 10.8
  Top Layer w0.254: OSC1.22 22.58,23.97 23.11,24.51 24.89,24.51 25.4,25.02 25.4,28.45 H2.12
PB12: length 10.8
  Top Layer w0.254: H2.13 25.27,32.89 19.64,27.26 OSC1.25
PB13: length 12.6
  Top Layer w0.254: H2.14 26.8,35.43 19.14,27.78 OSC1.26
PB14: length 15.1
  Top Layer w0.254: H2.15 26.03,36.7 26.03,35.69 18.64,28.29 OSC1.27
PB15: length 18.1
  Top Layer w0.254: OSC1.28 18.14,28.81 25.4,36.07 25.4,39.12 26.8,40.51 H2.16
PC13: length 16
  Top Layer w0.254: v1(14.6,19.43) 14.64,19.39 OSC1.2
  Bottom Layer w0.254: v1(14.6,19.43) 17.65,19.43 18.16,18.92 18.16,15.87 19.05,14.99 19.05,13.21 16.51,10.67 R3.2
SWDCLK: length 32.6
  Top Layer w0.254: OSC1.37 13.63,24.97 v1(14.48,24.13)
  Bottom Layer w0.254: v1(14.48,24.13) 22.99,24.13 25.27,26.42 25.27,32.51 22.73,35.05 22.73,39.37 21.97,40.13 20.19,40.13 H4.3
SWDIO: length 22.6
  Top Layer w0.254: OSC1.34 15.14,25.24 v1(15.62,24.76)
  Bottom Layer w0.254: v1(15.62,24.76) 16.64,24.76 20.19,28.32 21.84,28.32 24.64,31.11 24.64,31.88 21.84,34.67 21.84,38.48 21.46,38.86
$1N5715: length 6.6
  Top Layer w0.254: POWER.1 16.42,35.91 15.37,36.96 v1(12.45,36.96)
  Bottom Layer w0.254: v1(12.45,36.96) 11.22,36.96 R2.1
$1N6381: length 6.5
  Bottom Layer w0.254: H1.3 9.25,28.3 8,27.05 8,24.25 9.14,23.11
$1N6407: length 6.6
  Bottom Layer w0.254: H1.4 6.71,28.3 5.46,27.05 5.46,24.63 6.99,23.11
$1N9013: length 1.8
  Bottom Layer w0.254: U1.4 18.35,32.62 18.3,32.58
$1N15357: length 4.9
  Top Layer w0.254: v1(21.97,9.52) 20.61,9.52 USER.1
  Bottom Layer w0.254: v1(21.97,9.52) 21.96,9.54 R3.1
$1N15535: length 2.4
  Top Layer w0.254: v1(9.27,40) 9.28,40 USB1.B5
  Bottom Layer w0.254: v1(9.27,40) 9.27,40.08 R4.2
$1N15536: length 2.4
  Top Layer w0.254: v1(10.29,40) 10.28,40 USB1.A5
  Bottom Layer w0.254: v1(10.29,40) 11.19,40.91 R1.2

## Copper pours and planes (outline as drawn; the poured copper is in the pictures)
GND on Top Layer: 0.46,44.01 0.48,44.3 0.54,44.58 0.64,44.85 0.78,45.1 0.95,45.33 1.15,45.53 1.38,45.7 1.63,45.84 1.9,45.94 2.18,46 2.47,46.02 28.22,46.02 28.51,46 28.78,45.94 29.05,45.84 29.3,45.7 29.53,45.53 29.74,45.33 29.91,45.1 30.04,44.85 30.14,44.58 30.21,44.3 30.23,44.01 30.23,2.64 30.21,2.36 30.14,2.08 30.04,1.81 29.91,1.56 29.74,1.33 29.53,1.13 29.3,0.95 29.05,0.82 28.78,0.72 28.51,0.66 28.22,0.63 2.47,0.63 2.18,0.66 1.9,0.72 1.63,0.82 1.38,0.95 1.15,1.13 0.95,1.33 0.78,1.56 0.64,1.81 0.54,2.08 0.48,2.36 0.46,2.64
GND on Bottom Layer: 0.46,44.01 0.48,44.3 0.54,44.58 0.64,44.85 0.78,45.1 0.95,45.33 1.15,45.53 1.38,45.7 1.63,45.84 1.9,45.94 2.18,46 2.47,46.02 28.22,46.02 28.51,46 28.78,45.94 29.05,45.84 29.3,45.7 29.53,45.53 29.74,45.33 29.91,45.1 30.04,44.85 30.14,44.58 30.21,44.3 30.23,44.01 30.23,2.64 30.21,2.36 30.14,2.08 30.04,1.81 29.91,1.56 29.74,1.33 29.53,1.13 29.3,0.95 29.05,0.82 28.78,0.72 28.51,0.66 28.22,0.63 2.47,0.63 2.18,0.66 1.9,0.72 1.63,0.82 1.38,0.95 1.15,1.13 0.95,1.33 0.78,1.56 0.64,1.81 0.54,2.08 0.48,2.36 0.46,2.64

Small or netless copper shapes (teardrops, artwork), in the pictures only: 129 on Top Layer, 79 on Bottom Layer

## Text on the board
Bottom Silkscreen Layer: 10kΩ | 5.1kΩ | 100nF | 1uF | 100kΩ | 22pF | 100Ω | 1kΩ
Top Silkscreen Layer: 10kΩ | PB14 | PB13 | PB12 | PB11 | PB10 | PB1 | PB0 | PA7 | PA6 | PA5 | PA4 | PA3 | PA2 | PA1 | PA0 | PA8 | PA9 | PA10 | PA11 | PA12 | PA15 | PB3 | PB4 | PB5 | PB6 | PB7 | PB8 | PB9 | GND | 3.3V | 5V | 8MHz | 32.768MkHz
